# EAGLE schematic receiver (EAGLE 7.7.0)
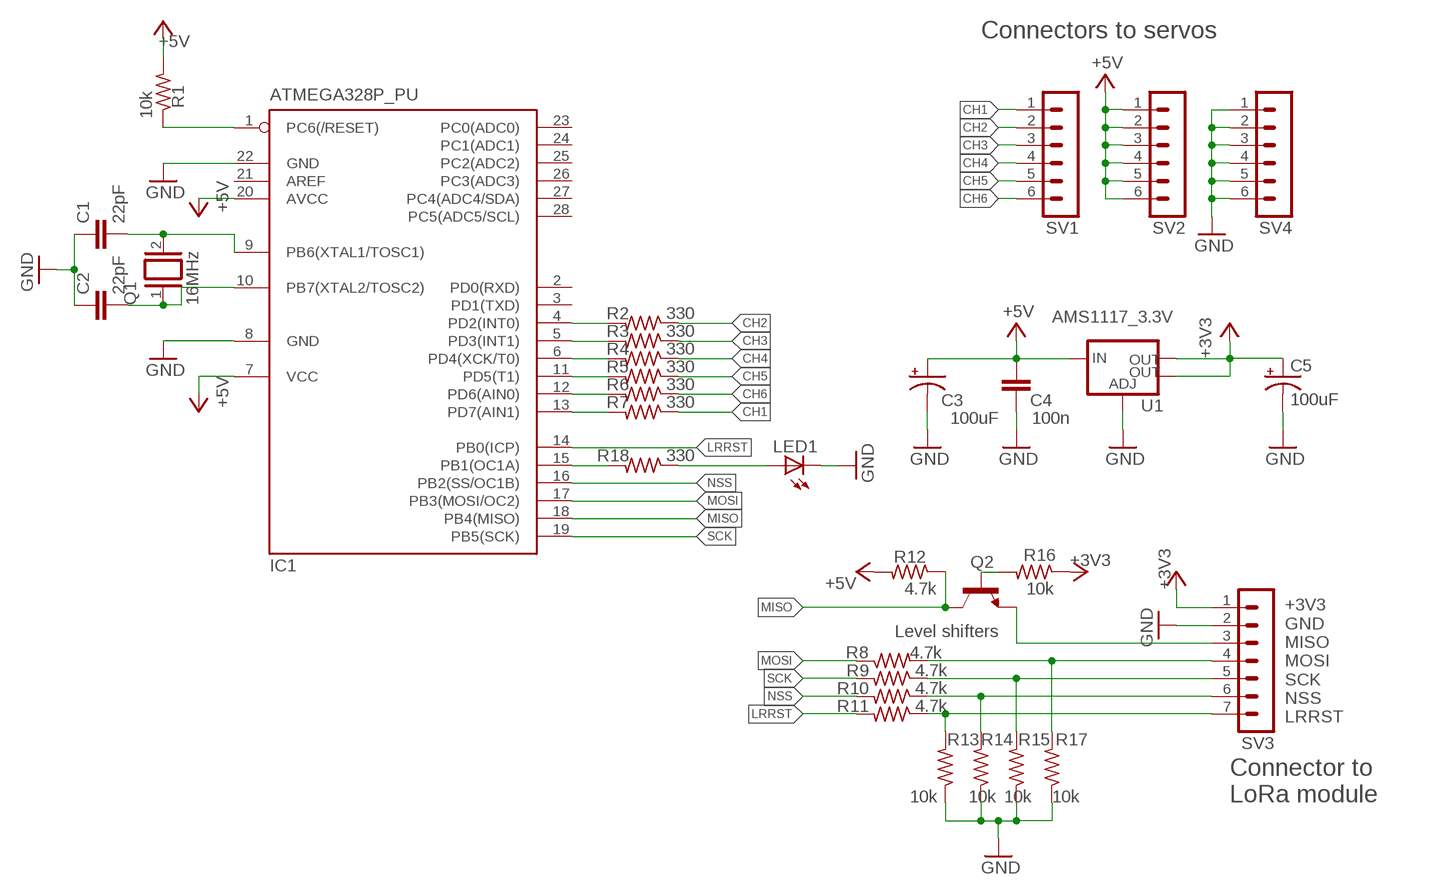
[diagram p0: schematic, sheet 1]

## Parts
C1  22pF  C-EU025-025X050  [C025-025X050]
C2  22pF  C-EU025-025X050  [C025-025X050]
C3  100uF  CPOL-USE2,5-6E  [E2,5-6E]
C4  100n  C-EU025-025X050  [C025-025X050]
C5  100uF  CPOL-USE2,5-6E  [E2,5-6E]
IC1  ATMEGA328P_PU  MEGA8-P  [DIL28-3]
LED1  LED3MM  [LED3MM]
Q1  16MHz  XTAL/S  [QS]
Q2  BC817-16SMD  [SOT23-BEC]
R1  10k  R-US_R0805  [R0805]
R2  330  R-US_R0805  [R0805]
R3  330  R-US_R0805  [R0805]
R4  330  R-US_R0805  [R0805]
R5  330  R-US_R0805  [R0805]
R6  330  R-US_R0805  [R0805]
R7  330  R-US_R0805  [R0805]
R8  4.7k  R-US_R0805  [R0805]
R9  4.7k  R-US_R0805  [R0805]
R10  4.7k  R-US_R0805  [R0805]
R11  4.7k  R-US_R0805  [R0805]
R12  4.7k  R-US_R0805  [R0805]
R13  10k  R-US_R0805  [R0805]
R14  10k  R-US_R0805  [R0805]
R15  10k  R-US_R0805  [R0805]
R16  10k  R-US_R0805  [R0805]
R17  10k  R-US_R0805  [R0805]
R18  330  R-US_R0805  [R0805]
SV1  MA06-1  [MA06-1]
SV2  MA06-1  [MA06-1]
SV3  MA07-1  [MA07-1]
SV4  MA06-1  [MA06-1]
U1  AMS1117_3.3V  V_REG_LM1117SOT223  [SOT223]

## Nets
+3V3: C5.+ R16.1 SV3.1 U1.2(OUT) U1.4(OUT)
+5V: C3.+ C4.2 IC1.7(VCC) IC1.20(AVCC) R1.2 R12.2 SV2.1 SV2.2 SV2.3 SV2.4 SV2.5 SV2.6 U1.3(IN)
CH1: R7.1 SV1.1
CH2: R2.1 SV1.2
CH3: R3.1 SV1.3
CH4: R4.1 SV1.4
CH5: R5.1 SV1.5
CH6: R6.1 SV1.6
GND: C1.1 C2.1 C3.- C4.1 C5.- IC1.8(GND) IC1.22(GND) LED1.K(C) R13.1 R14.1 R15.1 R17.1 SV3.2 SV4.1 SV4.2 SV4.3 SV4.4 SV4.5 SV4.6 U1.1(ADJ)
LRRST: IC1.14(PB0(ICP)) R11.2
MASTER_RST1: IC1.1(PC6(/RESET)) R1.1
MISO: IC1.18(PB4(MISO)) Q2.C R12.1
MOSI: IC1.17(PB3(MOSI/OC2)) R8.1
N$1: Q2.B R16.2
N$2: Q2.E SV3.3
N$3: R9.1 R15.2 SV3.5
N$4: R8.2 R17.2 SV3.4
N$5: IC1.4(PD2(INT0)) R2.2
N$6: IC1.5(PD3(INT1)) R3.2
N$7: IC1.6(PD4(XCK/T0)) R4.2
N$8: IC1.11(PD5(T1)) R5.2
N$9: IC1.12(PD6(AIN0)) R6.2
N$10: R10.1 R14.2 SV3.6
N$11: IC1.13(PD7(AIN1)) R7.2
N$12: R11.1 R13.2 SV3.7
N$13: LED1.A R18.1
N$14: IC1.15(PB1(OC1A)) R18.2
N$16: C1.2 IC1.9(PB6(XTAL1/TOSC1)) Q1.2
N$17: C2.2 IC1.10(PB7(XTAL2/TOSC2)) Q1.1
NSS: IC1.16(PB2(SS/OC1B)) R10.2
SCK: IC1.19(PB5(SCK)) R9.2
Unconnected: IC1.2(PD0(RXD)) IC1.3(PD1(TXD)) IC1.21(AREF) IC1.23(PC0(ADC0)) IC1.24(PC1(ADC1)) IC1.25(PC2(ADC2)) IC1.26(PC3(ADC3)) IC1.27(PC4(ADC4/SDA)) IC1.28(PC5(ADC5/SCL))

## Notes on the sheet
- Connectors to servos
- Level shifters
- +3V3
  GND
  MISO
  MOSI
  SCK
  NSS
  LRRST
- Connector to 
  LoRa module

## Library data of the parts
C1 C2 C4 = rcl:C-EU: CAPACITOR, European symbol
C3 C5 = rcl:CPOL-US: POLARIZED CAPACITOR, American symbol
IC1 = atmel:MEGA8-P: MICROCONTROLLER 8 Kbytes FLASH, 1 kbytes SRAM, 512 bytes EEPROM, USART, 4-channel 10 bit ADC, 2-channel 8 bit ADC Pin compatible with Atmega48, ATMega88, ATMega168 Source: avr.lbr; OC_FARNELL: unknown; OC_NEWARK: unknown
LED1 = led:LED: LED OSRAM: - CHIPLED LG R971, LG N971, LY N971, LG Q971, LY Q971, LO R971, LY R971 LH N974, LH R974 LS Q976, LO Q976, LY Q976 LO Q996 - Hyper CHIPLED LW Q18S LB Q993, LB Q99A, LB R99A - SideLED LS A670, LO A670, LY A670, LG A670, LP A670 LB A673, LV A673, LT A673, LW A673 LH A674 LY A675 LS A676, LA A676, LO A676, LY A676, LW A676 LS A679, LY A679, LG A679 - Hyper Micro SIDELED® LS Y876, LA Y876, LO Y876, LY Y876 LT Y87S - SmartLED LW L88C, LW L88S LB L89C, LB L89S, LG L890 LS L89K, LO L89K, LY L89K LS L896, LA L896, LO L896, LY L896 - TOPLED LS T670, LO T670, LY T670, LG T670, LP T670 LSG T670, LSP T670, LSY T670, LOP T670, LYG T670 LG T671, LOG T671, LSG T671 LB T673, LV T673, LT T673, LW T673 LH T674 LS T676, LA T676, LO T676, LY T676, LB T676, LH T676, LSB T676, LW T676 LB T67C, LV T67C, LT T67C, LS T67K, LO T67K, LY T67K, LW E67C LS E67B, LA E67B, LO E67B, LY E67B, LB E67C, LV E67C, LT E67C LW T67C LS T679, LY T679, LG T679 LS T770, LO T770, LY T770, LG T770, LP T770 LB T773, LV T773, LT T773, LW T773 LH T774 LS E675, LA E675, LY E675, LS T675 LS T776, LA T776, LO T776, LY T776, LB T776 LHGB T686 LT T68C, LB T68C - Hyper Mini TOPLED® LB M676 - Mini TOPLED Santana® LG M470 LS M47K, LO M47K, LY M47K Source: http://www.osram.convergy.de LUXEON: - LUMILED® LXK2-PW12-R00, LXK2-PW12-S00, LXK2-PW14-U00, LXK2-PW14-V00 LXK2-PM12-R00, LXK2-PM12-S00, LXK2-PM14-U00 LXK2-PE12-Q00, LXK2-PE12-R00, LXK2-PE12-S00, LXK2-PE14-T00, LXK2-PE14-U00 LXK2-PB12-K00, LXK2-PB12-L00, LXK2-PB12-M00, LXK2-PB14-N00, LXK2-PB14-P00, LXK2-PB14-Q00 LXK2-PR12-L00, LXK2-PR12-M00, LXK2-PR14-Q00, LXK2-PR14-R00 LXK2-PD12-Q00, LXK2-PD12-R00, LXK2-PD12-S00 LXK2-PH12-R00, LXK2-PH12-S00 LXK2-PL12-P00, LXK2-PL12-Q00, LXK2-PL12-R00 Source: www.luxeon.com KINGBRIGHT: KA-3528ASYC Source: www.kingbright.com
Q1 = special:XTAL/S: CRYSTAL
Q2 = transistor-npn:BC817*: NPN Transistor
R1-R18 = rcl:R-US_: RESISTOR, American symbol
SV1 SV2 SV4 = con-lstb:MA06-1: PIN HEADER; OC_FARNELL: unknown; OC_NEWARK: unknown
SV3 = con-lstb:MA07-1: PIN HEADER; OC_FARNELL: unknown; OC_NEWARK: unknown
U1 = SparkFun-PowerIC:V_REG_LM1117: Voltage Regulator LM1117 Standard adjustable voltage regulator but in SMD form. Spark Fun Electronics SKU : COM-00595; PROD_ID: VREG-08170